# Altium project ESP32_USB_C.PrjPcb (part 1 of 3)
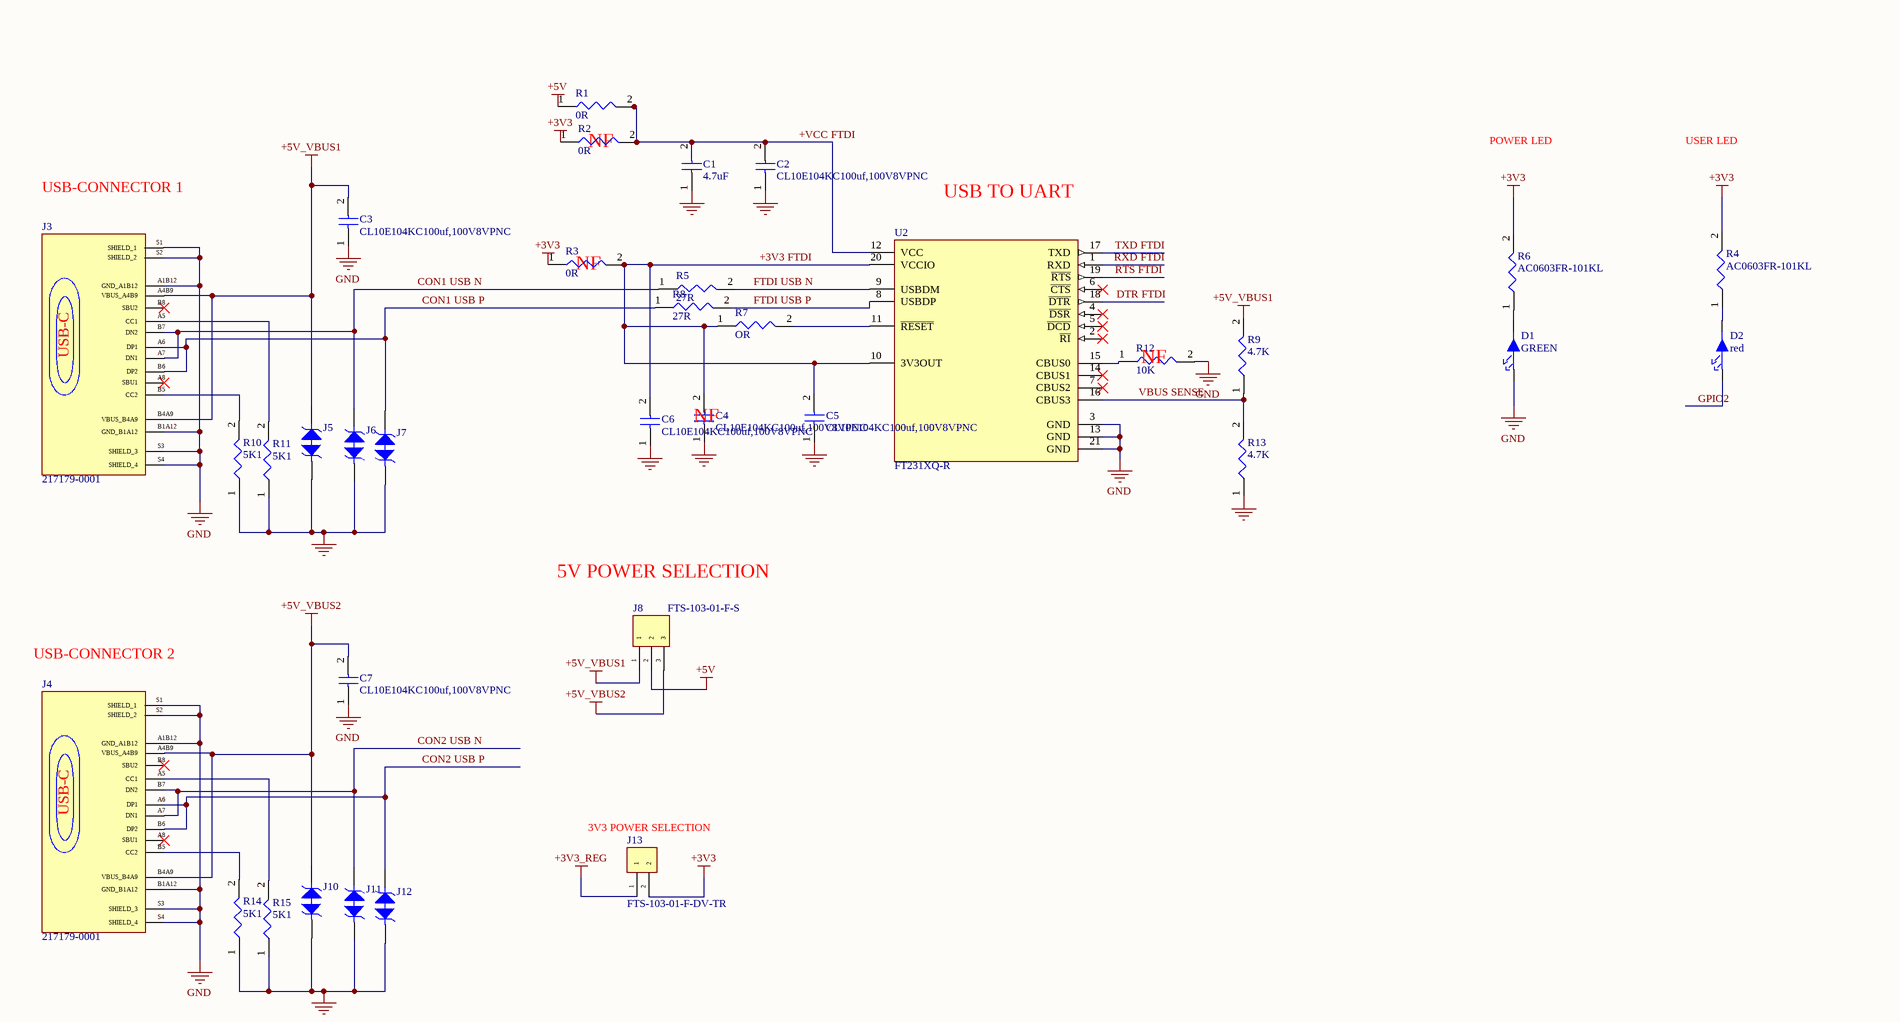
[diagram p0: ESP32_USB_C.SchDoc, top left]
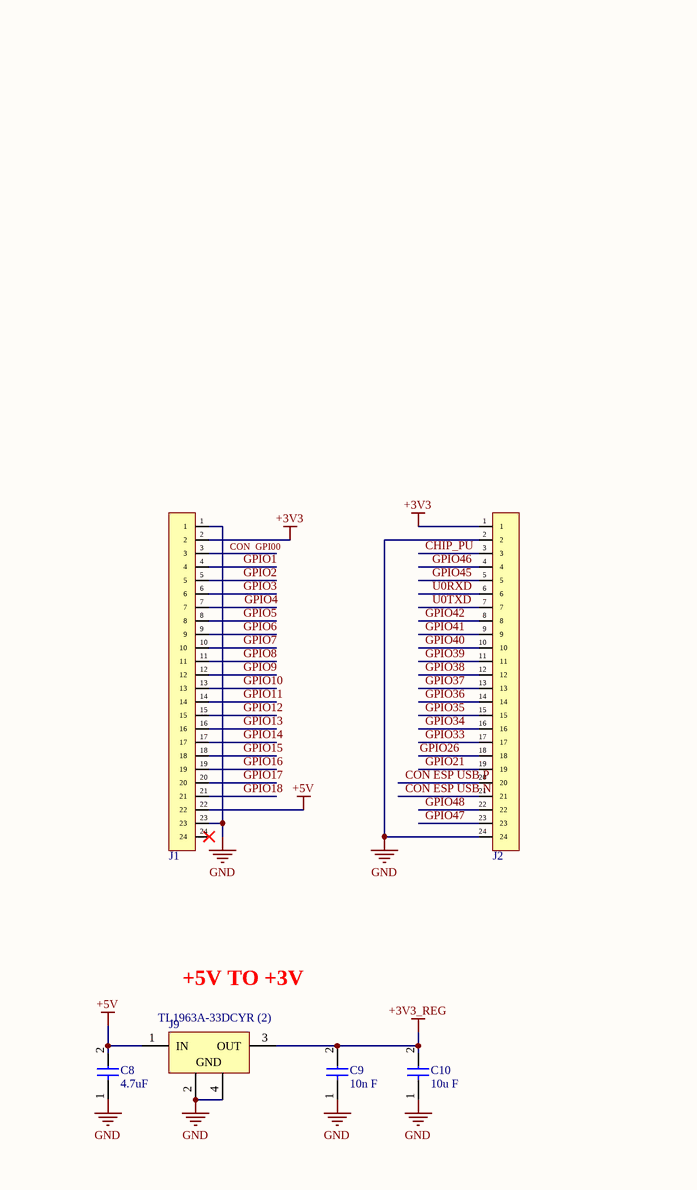
[diagram p1: ESP32_USB_C.SchDoc, top right]
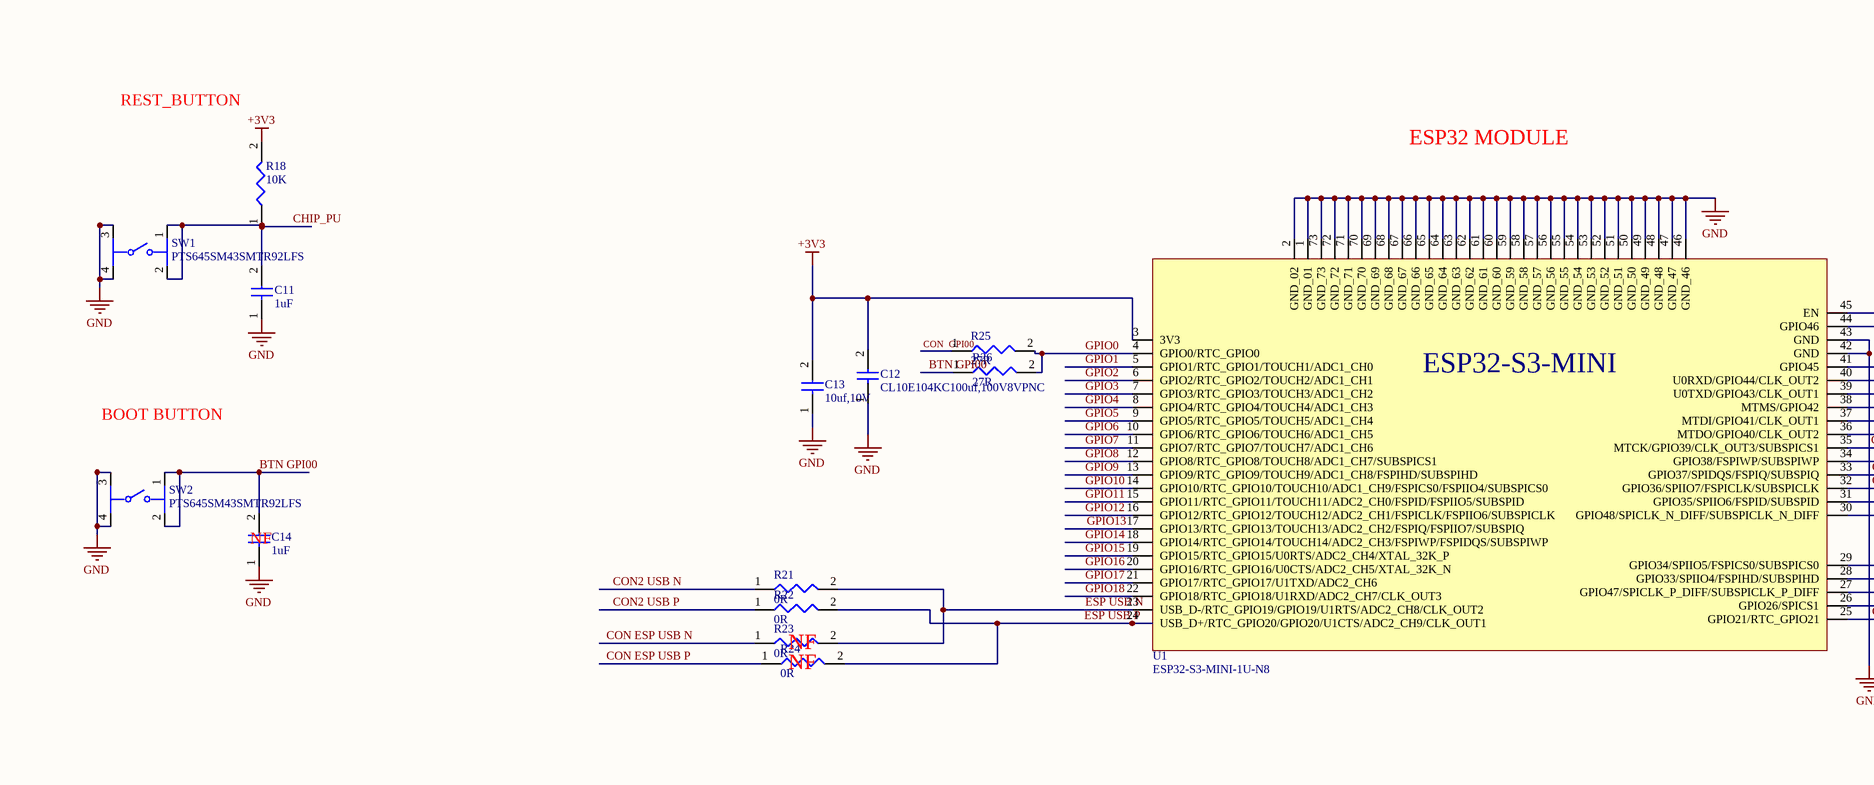
[diagram p2: ESP32_USB_C.SchDoc, bottom left]
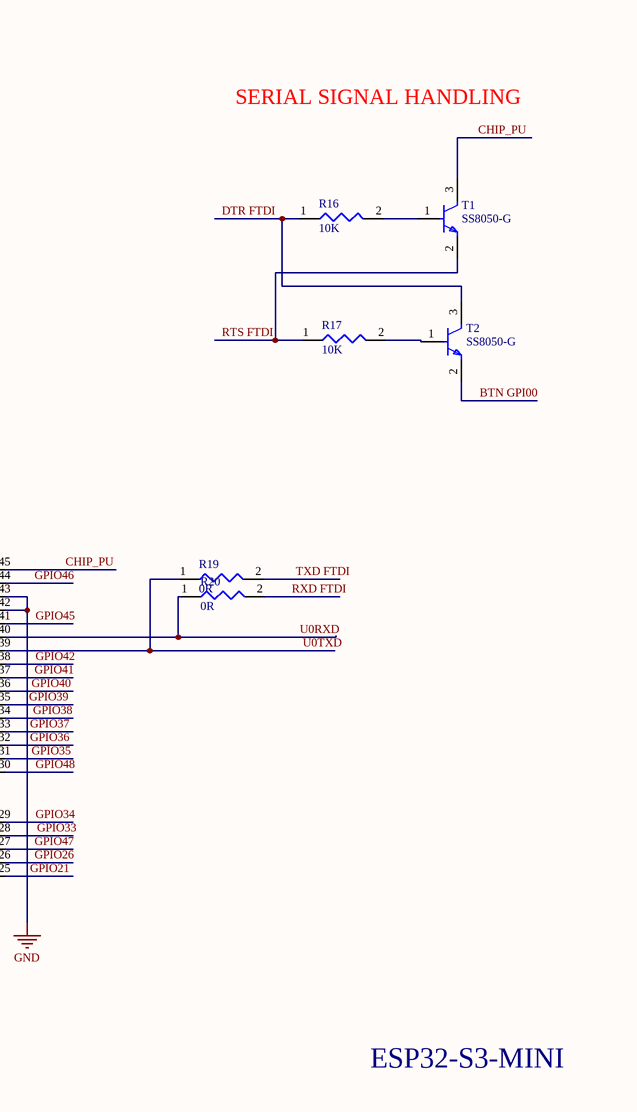
[diagram p3: ESP32_USB_C.SchDoc, bottom right]
1 sheet, 61 parts. Net scope: global (net labels, ports and power ports of the same name join across sheets).
Board file: ESP32_USB_C.PcbDoc

## Sheet ESP32_USB_C.SchDoc
size A2; SheetNumber: 1; SheetTotal: 1

### Parts
C1  4.7uF  [CAPC1005X55N]
C2  CL10E104KC100uf,100V8VPNC  [CAPC1005X55N]
C3  CL10E104KC100uf,100V8VPNC  [CAPC1005X55N]
C4  CL10E104KC100uf,100V8VPNC  [CAPC1005X55N]
C5  CL10E104KC100uf,100V8VPNC  [CAPC1005X55N]
C6  CL10E104KC100uf,100V8VPNC  [CAPC1005X55N]
C7  CL10E104KC100uf,100V8VPNC  [CAPC1005X55N]
C8  4.7uF  [CAPC1005X55N]
C9  10n F  [CAPC1005X55N]
C10  10u F  [CAPC1005X55N]
C11  1uF  [CAPC1005X55N]
C12  CL10E104KC100uf,100V8VPNC  [CAPC1005X55N]
C13  10uf,10V  [CAPC1005X55N]
C14  1uF  [CAPC1005X55N]
D1  GREEN  [FP-APHCM2012CGCK-F01-MFG]
D2  red  [LEDC2012X90N]
J1  22-28-4245  [7731111824LF]  (value not drawn)
J2  22-28-4245  [7731111824LF]  (value not drawn)
J3  217179-0001  [FP-2171790001-MFG]
J4  217179-0001  [FP-2171790001-MFG]
J5  AQ3045-01ETG  [RTVS_SOD882_LTF-M]  (value not drawn)
J6  AQ3045-01ETG  [RTVS_SOD882_LTF-M]  (value not drawn)
J7  AQ3045-01ETG  [RTVS_SOD882_LTF-M]  (value not drawn)
J8  FTS-103-01-F-S  [SAMTEC-FTS-103-01-X-S]
J9  TL1963A-33DCYR (2)  [DCY0004A_M]
J10  AQ3045-01ETG  [RTVS_SOD882_LTF-M]  (value not drawn)
J11  AQ3045-01ETG  [RTVS_SOD882_LTF-M]  (value not drawn)
J12  AQ3045-01ETG  [RTVS_SOD882_LTF-M]  (value not drawn)
J13  FTS-103-01-F-DV-TR  [HDRV2W40P0X127_1X2_254X214X400P]
R1  0R  [RESC1005X40N]
R2  0R  [RESC1005X40N]
R3  0R  [RESC1005X40N]
R4  AC0603FR-101KL  [RESC1005X40N]
R5  27R  [RESC1005X40N]
R6  AC0603FR-101KL  [RESC1005X40N]
R7  OR  [RESC1005X40N]
R8  27R  [RESC1005X40N]
R9  4.7K  [RESC1005X40N]
R10  5K1  [RESC1005X40N]
R11  5K1  [RESC1005X40N]
R12  10K  [RESC1005X40N]
R13  4.7K  [RESC1005X40N]
R14  5K1  [RESC1005X40N]
R15  5K1  [RESC1005X40N]
R16  10K  [RESC1005X40N]
R17  10K  [RESC1005X40N]
R18  10K  [RESC1005X40N]
R19  0R  [RESC1005X40N]
R20  0R  [RESC1005X40N]
R21  0R  [RESC1005X40N]
R22  0R  [RESC1005X40N]
R23  0R  [RESC1005X40N]
R24  0R  [RESC1005X40N]
R25  27R  [RESC1005X40N]
R26  27R  [RESC1005X40N]
SW1  PTS645SM43SMTR92LFS  [PTS645SM43SMTR92LFS_MFG]
SW2  PTS645SM43SMTR92LFS  [PTS645SM43SMTR92LFS_MFG]
T1  SS8050-G  [FP-SS8050-G-IPC_B]
T2  SS8050-G  [FP-SS8050-G-IPC_B]
U1  ESP32-S3-MINI-1U-N8  [XCVR_ESP32-S3-MINI-1U-N8]
U2  FT231XQ-R  [FP-QFN-20-IPC_B]

### Nets
+3V3: C12.2 C13.2 J1.2 J2.1 J13.2 R2.1 R3.1 R4.2 R6.2 R18.2 U1.3(3V3)
+3V3_REG: C9.2 C10.2 J9.3(OUT) J13.1
+5V: C8.2 J1.22 J8.2 J9.1(IN) R1.1
+5V_VBUS1: C3.2 J3.A4B9(VBUS_A4B9) J3.B4A9(VBUS_B4A9) J5.2 J8.1 R9.2
+5V_VBUS2: C7.2 J4.A4B9(VBUS_A4B9) J4.B4A9(VBUS_B4A9) J8.3 J10.2
GND: C1.1 C2.1 C3.1 C4.1 C5.1 C6.1 C7.1 C8.1 C9.1 C10.1 C11.1 C12.1 C13.1 C14.1 D1.1 J1.1 J1.23 J2.2 J2.24 J3.A1B12(GND_A1B12) J3.B1A12(GND_B1A12) J3.S1(SHIELD_1) J3.S2(SHIELD_2) J3.S3(SHIELD_3) J3.S4(SHIELD_4) J4.A1B12(GND_A1B12) J4.B1A12(GND_B1A12) J4.S1(SHIELD_1) J4.S2(SHIELD_2) J4.S3(SHIELD_3) J4.S4(SHIELD_4) J5.1 J6.1 J7.1 J9.2(GND) J9.4(GND) J10.1 J11.1 J12.1 R10.1 R11.1 R12.2 R13.1 R14.1 R15.1 SW1.3 SW1.4 SW2.3 SW2.4 U1.1(GND_01) U1.2(GND_02) U1.42(GND) U1.43(GND) U1.46(GND_46) U1.47(GND_47) U1.48(GND_48) U1.49(GND_49) U1.50(GND_50) U1.51(GND_51) U1.52(GND_52) U1.53(GND_53) U1.54(GND_54) U1.55(GND_55) U1.56(GND_56) U1.57(GND_57) U1.58(GND_58) U1.59(GND_59) U1.60(GND_60) U1.61(GND_61) U1.62(GND_62) U1.63(GND_63) U1.64(GND_64) U1.65(GND_65) U1.66(GND_66) U1.67(GND_67) U1.68(GND_68) U1.69(GND_69) U1.70(GND_70) U1.71(GND_71) U1.72(GND_72) U1.73(GND_73) U2.3(GND) U2.13(GND) U2.21(GND)
+3V3 FTDI: C4.2 C5.2 C6.2 R3.2 R7.1 U2.10(3V3OUT) U2.20(VCCIO)
+VCC FTDI: C1.2 C2.2 R1.2 R2.2 U2.12(VCC)
BTN GPI00: C14.2 R26.1 SW2.1 SW2.2 T2.2(E)
CHIP_PU: C11.2 J2.3 R18.1 SW1.1 SW1.2 T1.3(C) U1.45(EN)
CON1 USB N: J3.A7(DN1) J3.B7(DN2) J6.2 R5.1
CON1 USB P: J3.A6(DP1) J3.B6(DP2) J7.2 R8.1
CON2 USB N: J4.A7(DN1) J4.B7(DN2) J11.2 R21.1
CON2 USB P: J4.A6(DP1) J4.B6(DP2) J12.2 R22.1
CON  GPI00: J1.3 R25.1
CON ESP USB N: J2.21 R23.1
CON ESP USB P: J2.20 R24.1
DTR FTDI: R16.1 T2.3(C) U2.18(~{DTR})
ESP USB N: R21.2 R23.2 U1.23(USB_D-/RTC_GPIO19/GPIO19/U1RTS/ADC2_CH8/CLK_OUT2)
ESP USB P: R22.2 R24.2 U1.24(USB_D+/RTC_GPIO20/GPIO20/U1CTS/ADC2_CH9/CLK_OUT1)
FTDI USB N: R5.2 U2.9(USBDM)
FTDI USB P: R8.2 U2.8(USBDP)
GPIO0: R25.2 R26.2 U1.4(GPIO0/RTC_GPIO0)
GPIO1: J1.4 U1.5(GPIO1/RTC_GPIO1/TOUCH1/ADC1_CH0)
GPIO2: D2.1 J1.5 U1.6(GPIO2/RTC_GPIO2/TOUCH2/ADC1_CH1)
GPIO3: J1.6 U1.7(GPIO3/RTC_GPIO3/TOUCH3/ADC1_CH2)
GPIO4: J1.7 U1.8(GPIO4/RTC_GPIO4/TOUCH4/ADC1_CH3)
GPIO5: J1.8 U1.9(GPIO5/RTC_GPIO5/TOUCH5/ADC1_CH4)
GPIO6: J1.9 U1.10(GPIO6/RTC_GPIO6/TOUCH6/ADC1_CH5)
GPIO7: J1.10 U1.11(GPIO7/RTC_GPIO7/TOUCH7/ADC1_CH6)
GPIO8: J1.11 U1.12(GPIO8/RTC_GPIO8/TOUCH8/ADC1_CH7/SUBSPICS1)
GPIO9: J1.12 U1.13(GPIO9/RTC_GPIO9/TOUCH9/ADC1_CH8/FSPIHD/SUBSPIHD)
GPIO10: J1.13 U1.14(GPIO10/RTC_GPIO10/TOUCH10/ADC1_CH9/FSPICS0/FSPIIO4/SUBSPICS0)
GPIO11: J1.14 U1.15(GPIO11/RTC_GPIO11/TOUCH11/ADC2_CH0/FSPID/FSPIIO5/SUBSPID)
GPIO12: J1.15 U1.16(GPIO12/RTC_GPIO12/TOUCH12/ADC2_CH1/FSPICLK/FSPIIO6/SUBSPICLK)
GPIO13: J1.16 U1.17(GPIO13/RTC_GPIO13/TOUCH13/ADC2_CH2/FSPIQ/FSPIIO7/SUBSPIQ)
GPIO14: J1.17 U1.18(GPIO14/RTC_GPIO14/TOUCH14/ADC2_CH3/FSPIWP/FSPIDQS/SUBSPIWP)
GPIO15: J1.18 U1.19(GPIO15/RTC_GPIO15/U0RTS/ADC2_CH4/XTAL_32K_P)
GPIO16: J1.19 U1.20(GPIO16/RTC_GPIO16/U0CTS/ADC2_CH5/XTAL_32K_N)
GPIO17: J1.20 U1.21(GPIO17/RTC_GPIO17/U1TXD/ADC2_CH6)
GPIO18: J1.21 U1.22(GPIO18/RTC_GPIO18/U1RXD/ADC2_CH7/CLK_OUT3)
GPIO21: J2.19 U1.25(GPIO21/RTC_GPIO21)
GPIO26: J2.18 U1.26(GPIO26/SPICS1)
GPIO33: J2.17 U1.28(GPIO33/SPIIO4/FSPIHD/SUBSPIHD)
GPIO34: J2.16 U1.29(GPIO34/SPIIO5/FSPICS0/SUBSPICS0)
GPIO35: J2.15 U1.31(GPIO35/SPIIO6/FSPID/SUBSPID)
GPIO36: J2.14 U1.32(GPIO36/SPIIO7/FSPICLK/SUBSPICLK)
GPIO37: J2.13 U1.33(GPIO37/SPIDQS/FSPIQ/SUBSPIQ)
GPIO38: J2.12 U1.34(GPIO38/FSPIWP/SUBSPIWP)
GPIO39: J2.11 U1.35(MTCK/GPIO39/CLK_OUT3/SUBSPICS1)
GPIO40: J2.10 U1.36(MTDO/GPIO40/CLK_OUT2)
GPIO41: J2.9 U1.37(MTDI/GPIO41/CLK_OUT1)
GPIO42: J2.8 U1.38(MTMS/GPIO42)
GPIO45: J2.5 U1.41(GPIO45)
GPIO46: J2.4 U1.44(GPIO46)
GPIO47: J2.23 U1.27(GPIO47/SPICLK_P_DIFF/SUBSPICLK_P_DIFF)
GPIO48: J2.22 U1.30(GPIO48/SPICLK_N_DIFF/SUBSPICLK_N_DIFF)
RTS FTDI: R17.1 T1.2(E) U2.19(~{RTS})
RXD FTDI: R20.2 U2.1(RXD)
TXD FTDI: R19.2 U2.17(TXD)
U0RXD: J2.6 R20.1 U1.40(U0RXD/GPIO44/CLK_OUT2)
U0TXD: J2.7 R19.1 U1.39(U0TXD/GPIO43/CLK_OUT1)
VBUS SENSE: R9.1 R13.2 U2.16(CBUS3)
NetD1_2: D1.2 R6.1
NetD2_2: D2.2 R4.1
NetJ3_A5: J3.A5(CC1) R11.2
NetJ3_B5: J3.B5(CC2) R10.2
NetJ4_A5: J4.A5(CC1) R15.2
NetJ4_B5: J4.B5(CC2) R14.2
NetR7_2: R7.2 U2.11(~{RESET})
NetR12_1: R12.1 U2.15(CBUS0)
NetR16_2: R16.2 T1.1(B)
NetR17_2: R17.2 T2.1(B)

Not connected (* = marked no-connect by the designer): J1 24*; J3 A8(SBU1)* B8(SBU2)*; J4 A8(SBU1)* B8(SBU2)*; U2 2(~{RI})* 4(~{DSR})* 5(~{DCD})* 6(~{CTS})* 7(CBUS2)* 14(CBUS1)*

### Notes on the sheet
- USB-CONNECTOR 1
- (near R2) NF
- POWER LED
- USER LED
- USB TO UART
- (near R3) NF
- (near R12) NF
- (near C4) NF
- 5V POWER SELECTION
- (near J4) USB-CONNECTOR 2
- +5V TO +3V
- (near J13) 3V3 POWER SELECTION
- SERIAL SIGNAL HANDLING
- REST_BUTTON
- ESP32 MODULE
- BOOT BUTTON
- (near C14) NF
- (near R23) NF
- (near R24) NF
- ESP32-S3-MINI
- (in symbol 217179-0001) USB-C
- (in symbol ESP32-S3-MINI-1U-N8) ESP32-S3-MINI